# EAGLE design i2c_rs232_interface (EAGLE 7.3.0)
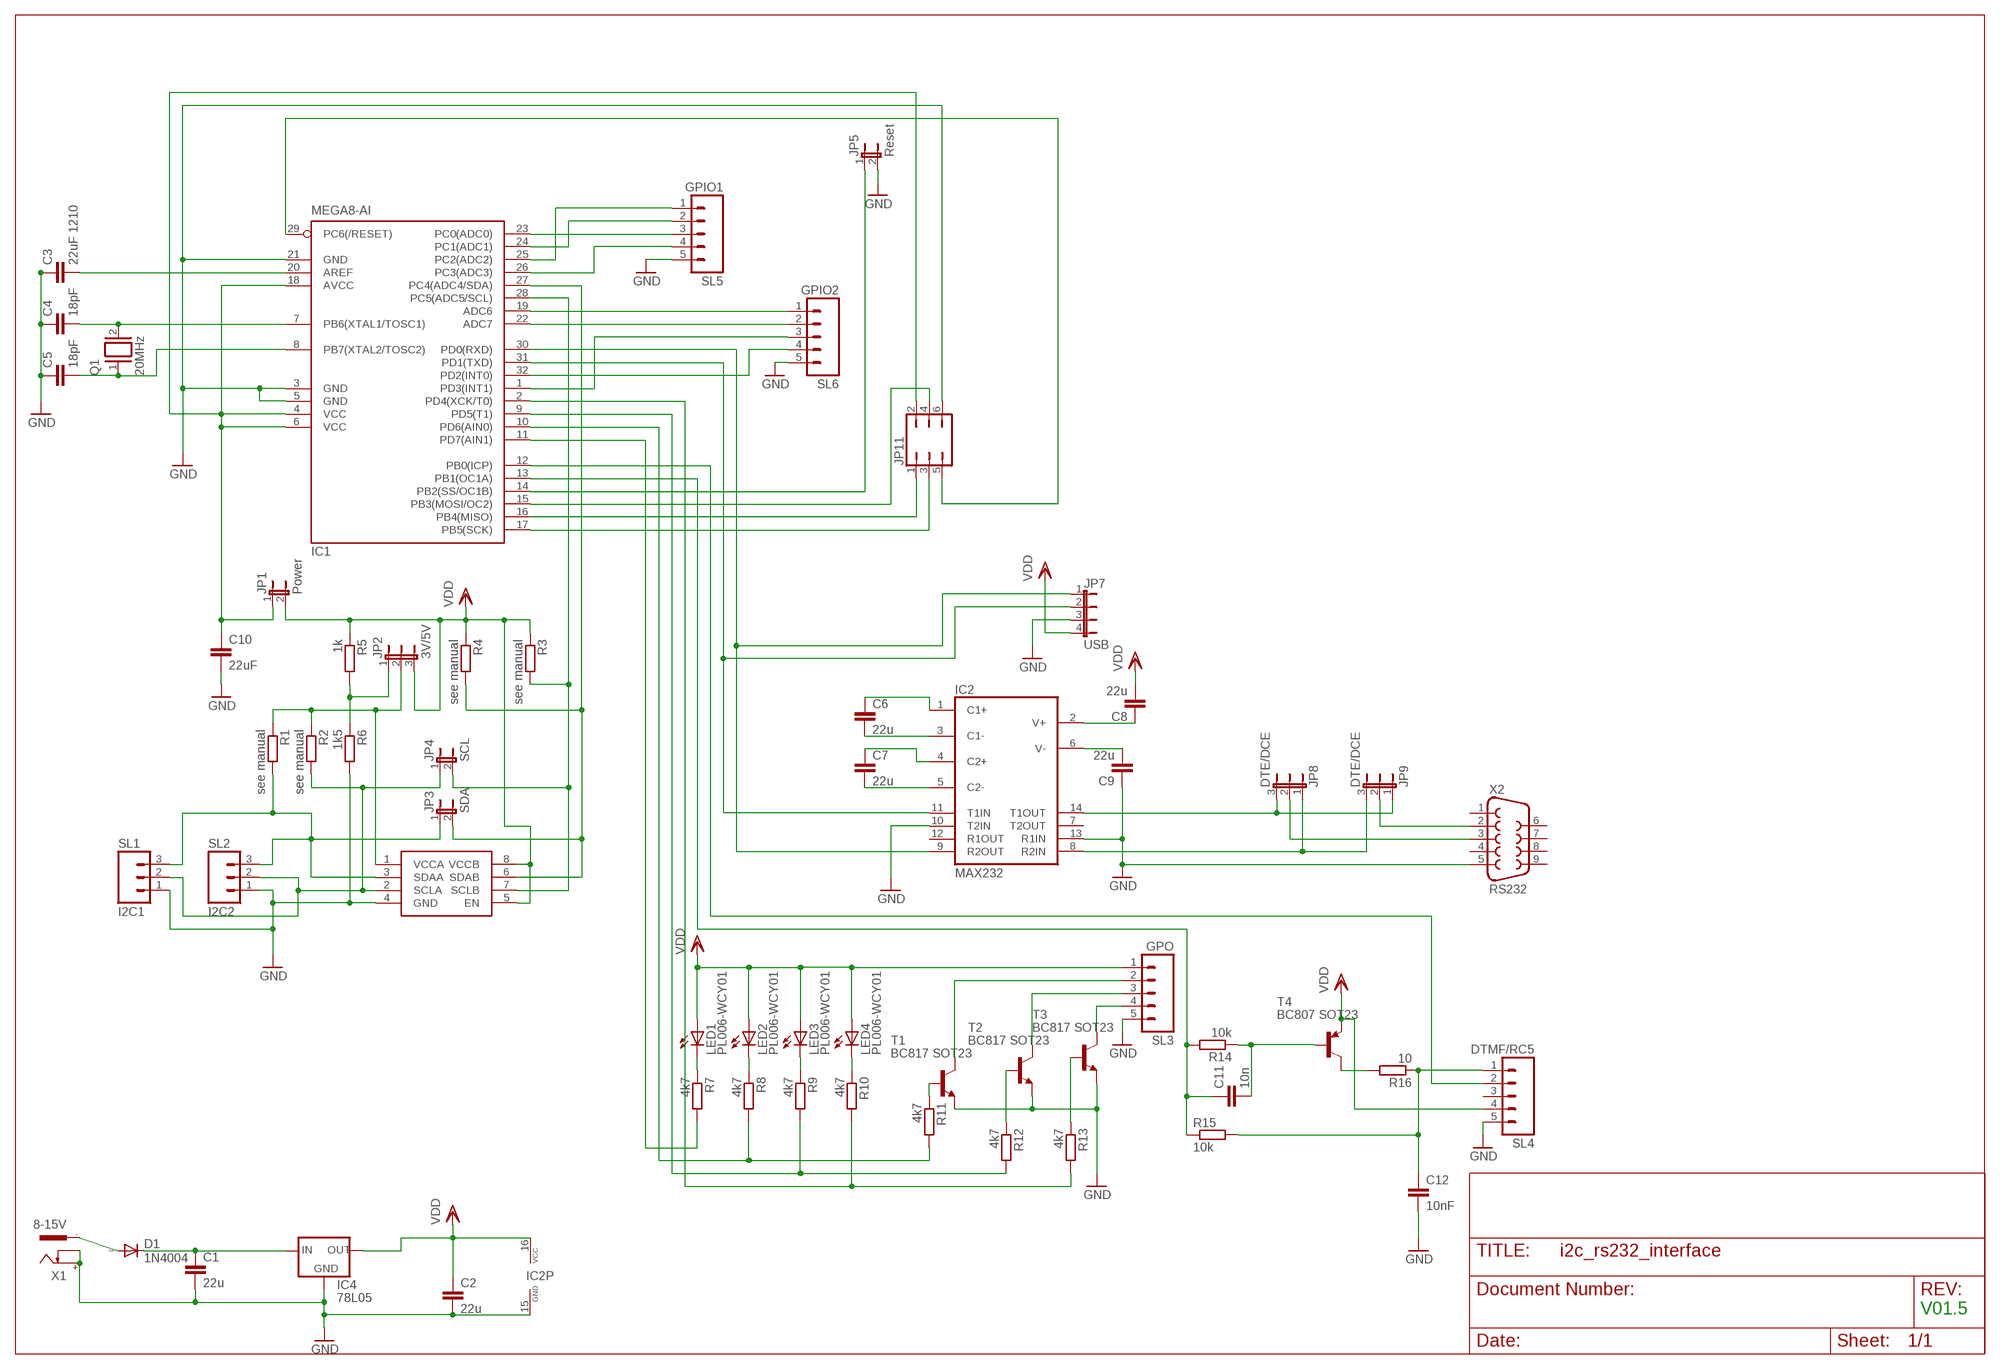
[diagram p0: schematic, sheet 1]

## Parts
C1  22u  C-EUC1206  [C1206]
C2  22u  C-EUC1206  [C1206]
C3  22uF 1210  C-EUC1206  [C1206]
C4  18pF  C-EU025-025X050  [C025-025X050]
C5  18pF  C-EU025-025X050  [C025-025X050]
C6  22u  C-EUC1206  [C1206]
C7  22u  C-EUC1206  [C1206]
C8  22u  C-EUC1206  [C1206]
C9  22u  C-EUC1206  [C1206]
C10  22uF  C-EUC1206  [C1206]
C11  10n  C-EUC1206  [C1206]
C12  10nF  C-EUC1206  [C1206]
D1  1N4004  [DO41-10]
IC1  MEGA8-AI  [TQFP32-08]
IC2  MAX232  [DIL16]
IC3  PCA9517  [SO-08]
IC4  78L05  78LXX  [78LXX]
JP1  Power  JP1E  [JP1]
JP2  3V/5V  JP2E  [JP2]
JP3  SDA  JP1E  [JP1]
JP4  SCL  JP1E  [JP1]
JP5  Reset  JP1E  [JP1]
JP7  USB  JP4E  [JP4]
JP8  DTE/DCE  JP2E  [JP2]
JP9  DTE/DCE  JP2E  [JP2]
JP11  JP3Q  [JP3Q]
LED1  PL006-WCY01  [SOT23]
LED2  PL006-WCY01  [SOT23]
LED3  PL006-WCY01  [SOT23]
LED4  PL006-WCY01  [SOT23]
Q1  20MHz  XTAL/S  [QS]
R1  see manual  R-EU_R1206  [R1206]
R2  see manual  R-EU_R1206  [R1206]
R3  see manual  R-EU_R1206  [R1206]
R4  see manual  R-EU_R1206  [R1206]
R5  1k  R-EU_R1206  [R1206]
R6  1k5  R-EU_R1206  [R1206]
R7  4k7  R-EU_R1206  [R1206]
R8  4k7  R-EU_R1206  [R1206]
R9  4k7  R-EU_R1206  [R1206]
R10  4k7  R-EU_R1206  [R1206]
R11  4k7  R-EU_R1206  [R1206]
R12  4k7  R-EU_R1206  [R1206]
R13  4k7  R-EU_R1206  [R1206]
R14  10k  R-EU_R1206  [R1206]
R15  10k  R-EU_R1206  [R1206]
R16  10  R-EU_R1206  [R1206]
SL1  I2C1  M03  [03P]
SL2  I2C2  M03  [03P]
SL3  GPO  M05  [05P]
SL4  DTMF/RC5  M05  [05P]
SL5  GPIO1  M05  [05P]
SL6  GPIO2  M05  [05P]
T1  BC817 SOT23  BC817-NPN-SOT23-BEC  [SOT23-BEC]
T2  BC817 SOT23  BC817-NPN-SOT23-BEC  [SOT23-BEC]
T3  BC817 SOT23  BC817-NPN-SOT23-BEC  [SOT23-BEC]
T4  BC807 SOT23  BC807-25SMD  [SOT23-BEC]
X1  8-15V  737992-55  [737992-5]
X2  RS232  F09H  [F09H]

## Nets
C13: C6.1 IC2.1(C1+)
GND: C1.2 C2.2 C3.1 C4.1 C5.1 C9.1 C10.2 C12.2 IC1.3(GND) IC1.5(GND) IC1.21(GND) IC2.10(T2IN) IC2.13(R1IN) IC2.15(GND) IC3.4(GND) IC4.GND JP5.2 JP7.3 JP11.6 R6.2 SL1.1 SL2.1 SL3.5 SL4.5 SL5.5 SL6.5 T1.E T2.E T3.E X1.+ X1.K X2.5
N$1: IC1.11(PD7(AIN1)) R7.2
N$2: IC1.30(PD0(RXD)) IC2.9(R2OUT) JP7.1
N$3: C7.2 IC2.5(C2-)
N$4: JP9.2 X2.2
N$5: IC1.27(PC4(ADC4/SDA)) IC3.6(SDAB) JP3.2 R4.2
N$6: IC1.14(PB2(SS/OC1B)) JP5.1
N$7: IC1.25(PC2(ADC2)) SL5.1
N$8: R11.1 T1.B
N$9: JP8.2 X2.3
N$10: IC2.14(T1OUT) JP8.3 JP9.1
N$11: C10.1 IC1.4(VCC) IC1.6(VCC) IC1.18(AVCC) JP1.1 JP11.2
N$12: IC1.31(PD1(TXD)) IC2.11(T1IN) JP7.2
N$13: C7.1 IC2.4(C2+)
N$14: C6.2 IC2.3(C1-)
N$15: IC1.16(PB4(MISO)) JP11.1
N$16: C8.1 IC2.2(V+)
N$17: C9.2 IC2.6(V-)
N$18: IC1.29(PC6(/RESET)) JP11.5
N$19: C4.2 IC1.7(PB6(XTAL1/TOSC1)) Q1.2
N$20: IC1.17(PB5(SCK)) JP11.3
N$21: IC1.19(ADC6) SL6.1
N$22: IC1.28(PC5(ADC5/SCL)) IC3.7(SCLB) JP4.2 R3.2
N$23: IC1.10(PD6(AIN0)) R8.2 R11.2
N$24: R13.1 T3.B
N$25: IC1.9(PD5(T1)) R9.2 R12.2
N$26: IC1.23(PC0(ADC0)) SL5.3
N$27: D1.A X1.-1
N$28: IC1.15(PB3(MOSI/OC2)) JP11.4
N$29: C11.2 R14.1 T4.B
N$30: C11.1 IC1.13(PB1(OC1A)) R14.2 R15.1
N$31: R16.2 T4.C
N$32: C12.1 R15.2 R16.1 SL4.1
N$33: C1.1 D1.C IC4.IN
N$34: R12.1 T2.B
N$35: C3.2 IC1.20(AREF)
N$36: IC1.24(PC1(ADC1)) SL5.2
N$37: C5.2 IC1.8(PB7(XTAL2/TOSC2)) Q1.1
N$38: IC3.2(SCLA) JP4.1 R2.2 SL1.2 SL2.2
N$39: IC1.26(PC3(ADC3)) SL5.4
N$40: IC1.1(PD3(INT1)) SL6.3
N$41: IC2.8(R2IN) JP8.1 JP9.3
N$42: IC1.12(PB0(ICP)) SL4.2
N$43: LED4.3(C) R10.1
N$44: IC3.3(SDAA) JP3.1 R1.2 SL1.3 SL2.3
N$45: SL3.2 T1.C
N$46: SL3.3 T2.C
N$47: SL3.4 T3.C
N$48: LED3.3(C) R9.1
N$49: LED2.3(C) R8.1
N$50: LED1.3(C) R7.1
N$51: IC1.32(PD2(INT0)) SL6.4
N$52: IC1.2(PD4(XCK/T0)) R10.2 R13.2
N$53: JP2.1 R5.2 R6.1
N$54: IC1.22(ADC7) SL6.2
N$56: IC3.1(VCCA) JP2.2 R1.1 R2.1
VDD: C2.1 C8.2 IC2.16(VCC) IC3.5(EN) IC3.8(VCCB) IC4.OUT JP1.2 JP2.3 JP7.4 LED1.1(A) LED2.1(A) LED3.1(A) LED4.1(A) R3.1 R4.1 R5.1 SL3.1 SL4.4 T4.E
Unconnected: IC2.7(T2OUT) IC2.12(R1OUT) SL4.3 X1.-2 X2.1 X2.4 X2.6 X2.7 X2.8 X2.9

## Notes on the sheet
- V01.5

## Library data of the parts
C1-C3 C6-C10 = rcl:C-EU: CAPACITOR, European symbol
C4 C5 C11 C12 = resistor:C-EU: CAPACITOR, European symbol
D1 = diode:1N4004: DIODE general purpose rectifier, 1 A
IC1 = atmel:MEGA8: MICROCONTROLLER 8 Kbytes FLASH, 1 kbytes SRAM, 512 bytes EEPROM, USART, 6-channel 10 bit ADC, 2-channel 8 bit ADC Pin compatible with Atmega48, ATMega88, ATMega168 Source: avr.lbr; MPN: ATMEGA8-16AU; OC_FARNELL: 9171371; OC_NEWARK: 73M8863
IC2 = maxim:MAX232: RS232 TRANSCEIVER; MF: MAXIM; MPN: MAX232ACPE+; OC_FARNELL: 9723773; OC_NEWARK: 68K4544
IC3 = PCA9517:PCA9517: PCA9517
IC4 = v-reg:78LXX: VOLTAGE REGULATOR
JP1 JP3-JP5 = jumper:JP1E: JUMPER
JP2 JP8 JP9 = jumper:JP2E: JUMPER
JP7 = jumper:JP4E: JUMPER
JP11 = jumper:JP3Q: JUMPER
LED1-LED4 = led:PL006*: PLH006 Series SMD LED SOT23 PLH006-WCR21 Super Red PLH006-WCR12 High Eff Red PLH006-WCG13 Green PLH006-WCY01 Yellow www.p-tec.net Source: http://www.wittig-electronic.de/PTEC/PL006Series.pdf
Q1 = special:XTAL/S: CRYSTAL
R1-R16 = resistor:R-EU_: RESISTOR, European symbol
SL1 SL2 = con-amp-quick:M03: AMP QUICK CONNECTOR; OC_FARNELL: unknown; OC_NEWARK: unknown
SL3-SL6 = con-amp-quick:M05: AMP QUICK CONNECTOR; OC_FARNELL: unknown; OC_NEWARK: unknown
T1-T3 = transistor:*-NPN-: NPN Transistror BF959 corrected 2008.03.06
T4 = transistor-pnp:BC807*: PNP Transistror
X1 = con-conrad:737992-55: FEMALE PRINT CONNECTOR DIN 45323 (34V/3A), ROKA, distributor Conrad
X2 = con-subd:F09: SUB-D; OC_FARNELL: unknown; OC_NEWARK: unknown

## Board
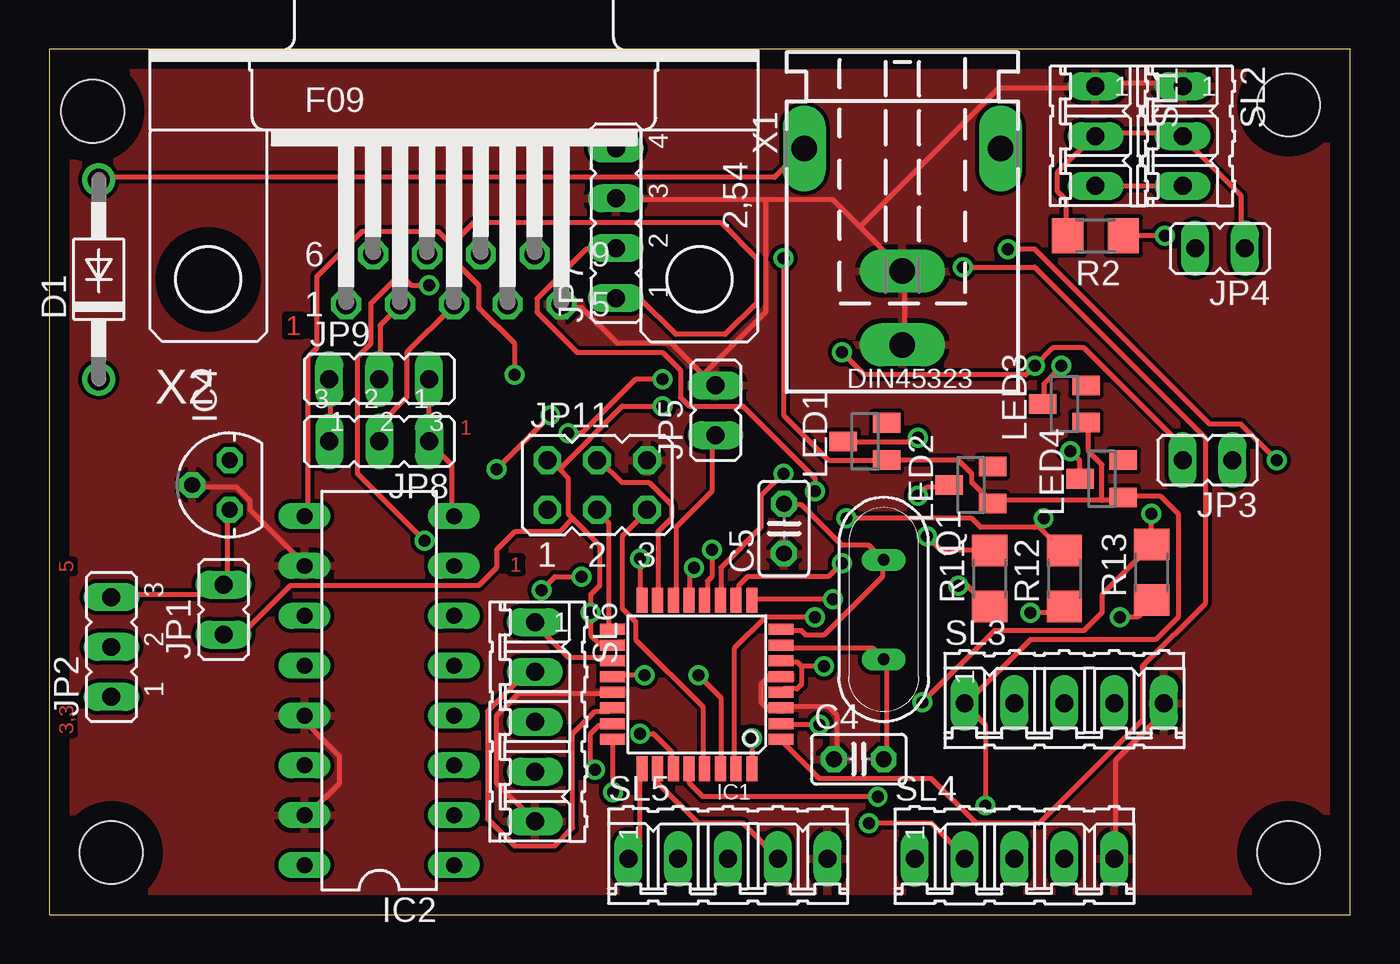
[diagram p1: board, top side]
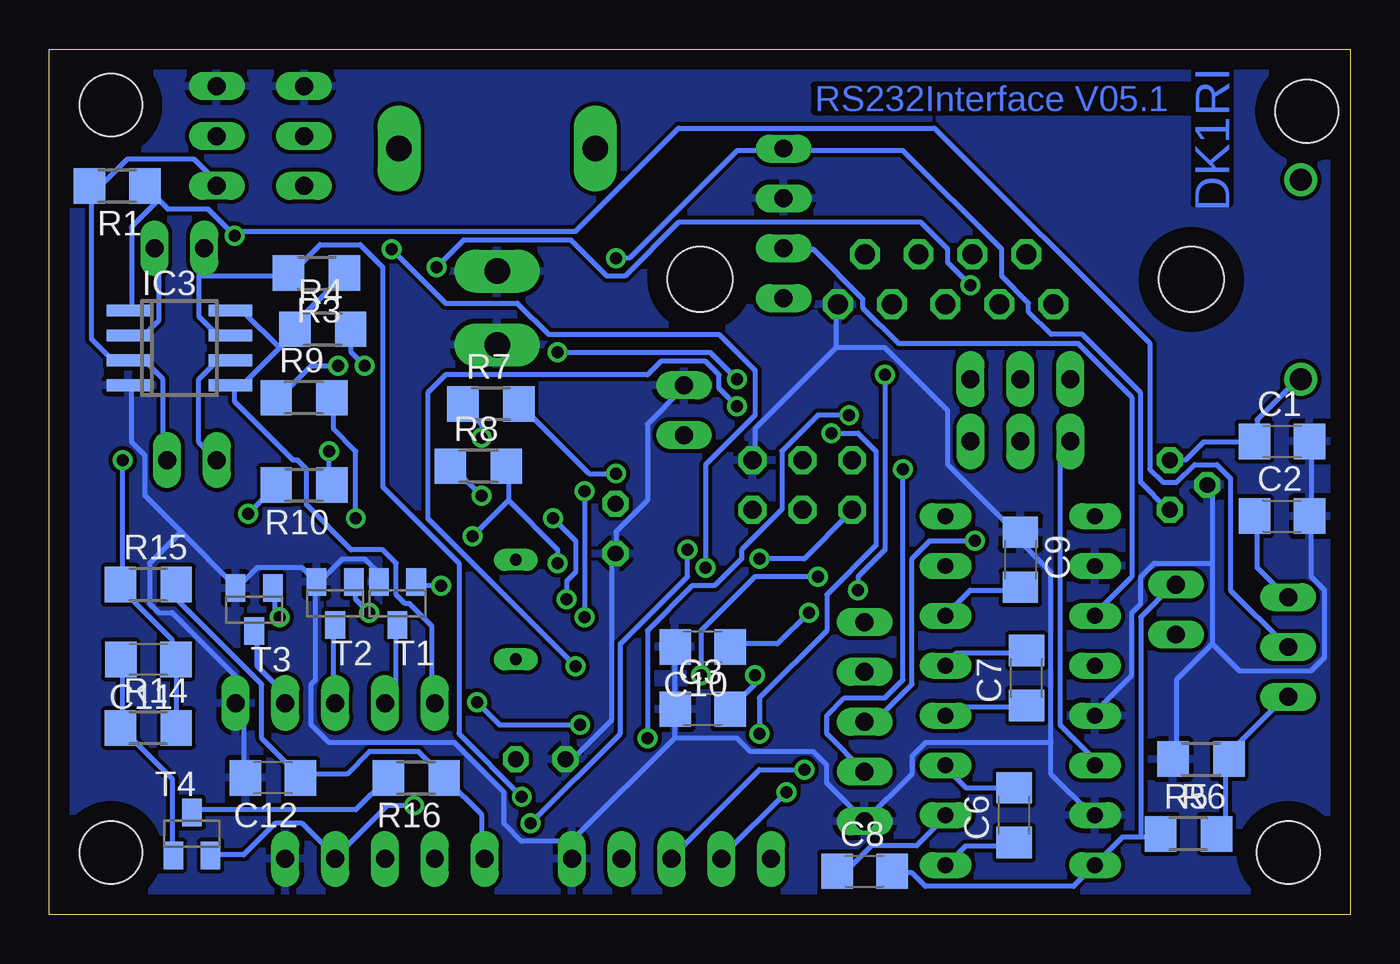
[diagram p2: board, bottom side, seen from below]

Size 66.34 x 44.12 mm. Coordinates in mm from the lower left corner, seen from the top.
Outline: 0,0 66.34,0 66.34,44.12 0,44.12 0,0
Copper layers (1*16): Top 0.035mm / dielectric 1.5mm / Bottom 0.035mm
Design rules "default": minimum track width 10mil, minimum drill 24mil, track to track 8mil, track to pad 8mil, pad to pad 8mil, via to via 8mil, smd to smd 8mil, copper to edge 40mil, drill to drill 8mil, minimum pad ring 10mil, minimum via ring 8mil, stop-mask expansion 4mil, vias tented up to drill 0mil, thermal gap 10mil
Holes 3.2 mm at 2.22,40.96 63.18,41.27 63.18,3.17 3.17,3.17

### Footprints (pad centres in the part's own frame; a part is rotated, then mirrored left to right if it is on the bottom)
C1206 = smd 1.6 x 1.8: 1 -1.4,0; 2 1.4,0
C025-025X050 = drill 0.813 octagon: 1 -1.27,0; 2 1.27,0
DO41-10 = drill 1.118: A 5.08,0; C -5.08,0
TQFP32-08 = smd 1.27 x 0.559: 1 -4.293,2.8; 2 -4.293,2; 3 -4.293,1.2; 4 -4.293,0.4; 5 -4.293,-0.4; 6 -4.293,-1.2; 7 -4.293,-2; 8 -4.293,-2.8; 17 4.293,-2.8; 18 4.293,-2; 19 4.293,-1.2; 20 4.293,-0.4; 21 4.293,0.4; 22 4.293,1.2; 23 4.293,2; 24 4.293,2.8 | smd 0.559 x 1.27: 9 -2.8,-4.293; 10 -2,-4.293; 11 -1.2,-4.293; 12 -0.4,-4.293; 13 0.4,-4.293; 14 1.2,-4.293; 15 2,-4.293; 16 2.8,-4.293; 25 2.8,4.293; 26 2,4.293; 27 1.2,4.293; 28 0.4,4.293; 29 -0.4,4.293; 30 -1.2,4.293; 31 -2,4.293; 32 -2.8,4.293
DIL16 = drill 0.813 long: 1 -8.89,-3.81; 2 -6.35,-3.81; 3 -3.81,-3.81; 4 -1.27,-3.81; 5 1.27,-3.81; 6 3.81,-3.81; 7 6.35,-3.81; 8 8.89,-3.81; 9 8.89,3.81; 10 6.35,3.81; 11 3.81,3.81; 12 1.27,3.81; 13 -1.27,3.81; 14 -3.81,3.81; 15 -6.35,3.81; 16 -8.89,3.81
SO-08 = smd 0.6 x 2.2: 1 -1.905,-2.6; 2 -0.635,-2.6; 3 0.635,-2.6; 4 1.905,-2.6; 5 1.905,2.6; 6 0.635,2.6; 7 -0.635,2.6; 8 -1.905,2.6
78LXX = drill 0.813 octagon: GND 0,1.905; IN 1.27,0; OUT -1.27,0
JP1 = drill 0.914 long: 1 0,-1.27; 2 0,1.27
JP2 = drill 0.914 long: 1 -2.54,0; 2 0,0; 3 2.54,0
JP4 = drill 0.914 long: 1 -3.81,0; 2 -1.27,0; 3 1.27,0; 4 3.81,0
JP3Q = drill 0.914 octagon: 1 -2.54,-1.27; 2 -2.54,1.27; 3 0,-1.27; 4 0,1.27; 5 2.54,-1.27; 6 2.54,1.27
SOT23 = smd 1 x 1.4: 1 -0.95,-1.1; 2 0.95,-1.1; 3 0,1.1
QS = drill 0.61 long: 1 -2.54,0; 2 2.54,0
R1206 = smd 1.6 x 1.803: 1 -1.422,0; 2 1.422,0
03P = drill 0.914 long: 1 -2.54,0; 2 0,0; 3 2.54,0
05P = drill 0.914 long: 1 -5.08,0; 2 -2.54,0; 3 0,0; 4 2.54,0; 5 5.08,0
SOT23-BEC = smd 1 x 1.4: B -0.95,-1.1; C 0,1.1; E 0.95,-1.1
737992-5 = drill 1.3 pad 2.184 long: + 0,10; -1 5,0; -2 -5,0; K 0,6.25
F09H = drill 1.016 octagon: 1 -5.486,-1.27; 2 -2.743,-1.27; 3 0,-1.27; 4 2.743,-1.27; 5 5.486,-1.27; 6 -4.115,1.27; 7 -1.372,1.27; 8 1.372,1.27; 9 4.115,1.27 | hole 3.302: -12.522,0; 12.522,0

### Placement (x,y rotation side)
C1  3.49,24.13 0 bottom
C2  3.49,20.32 0 bottom
C3  33.02,10.48 0 bottom
C4  41.27,7.94 0 top
C5  37.47,19.68 90 top
C6  17.14,5.08 90 bottom
C7  16.51,12.06 90 bottom
C8  24.76,2.22 0 bottom
C9  16.83,18.1 270 bottom
C10  33.02,13.65 180 bottom
C11  61.28,13.02 180 bottom
C12  54.93,6.99 180 bottom
D1  2.54,32.38 90 top
IC1  33.02,11.75 180 top
IC2  16.83,11.43 90 top
IC3  59.69,28.89 270 bottom
IC4  9.21,21.91 90 top
JP1  8.89,15.56 0 top
JP2  3.17,13.65 90 top
JP3  59.05,23.18 90 top
JP4  59.69,33.97 90 top
JP5  33.97,25.72 0 top
JP7  28.89,35.24 90 top
JP8  16.83,24.13 180 top
JP9  16.83,27.3 0 top
JP11  27.94,21.91 0 top
LED1  41.59,24.13 90 top
LED2  46.99,21.91 90 top
LED3  51.75,26.04 90 top
LED4  53.66,22.22 90 top
Q1  42.55,15.56 270 top
R1  62.86,37.15 180 bottom
R2  53.34,34.61 180 top
R3  52.7,32.7 180 bottom
R4  52.39,29.84 0 bottom
R5  8.25,4.13 0 bottom
R6  7.62,7.94 180 bottom
R7  43.81,26.04 0 bottom
R8  44.45,22.86 0 bottom
R9  53.34,26.35 0 bottom
R10  53.34,21.91 180 bottom
R11  47.94,17.14 90 top
R12  51.75,17.14 90 top
R13  56.2,17.46 90 top
R14  61.28,9.52 0 bottom
R15  61.28,16.83 0 bottom
R16  47.62,6.99 180 bottom
SL1  53.34,39.69 270 top
SL2  57.78,39.69 270 top
SL3  51.75,10.79 0 top
SL4  49.21,2.86 0 top
SL5  34.61,2.86 0 top
SL6  24.76,9.84 270 top
T1  48.58,15.88 180 bottom
T2  51.75,15.88 180 bottom
T3  55.88,15.56 180 bottom
T4  59.05,4.13 0 bottom
X1  43.5,39.05 180 top
X2  20.64,32.38 0 top

### Tracks (layer width: path | path; a pad name or v marks a point on that pad's centre or on a via)
C13
  Bottom 0.254: C6.1 17.32,3.52 19.61,3.52 20.52,2.6 IC2.1
GND
  Top 0.254: IC1.5 37.21,11.98 36.52,11.98 36.3,11.75 36.3,10.83 36.52,10.6 37.21,10.6 IC1.3 37.44,10.6 39.73,10.6 40.18,10.15 40.18,8.09 C4.1 | 33.33,27.52 33.78,27.06 JP5.2 33.33,27.52 | 33.33,27.52 31.72,29.12 28.98,29.12 27.15,30.95 26.24,30.95 X2.5 | SL2.1 57.78,42.38 53.44,42.38 SL1.1 53.21,42.15 48.41,42.15 41.33,35.06 | 36.52,36.44 39.95,36.44 41.33,35.06 | 36.52,36.44 28.98,36.44 JP7.3 | 41.33,35.06 43.38,33.01 X1.K 43.61,32.78 43.61,29.12 X1.+ | 33.33,27.52 36.52,30.72 36.52,36.44 | SL4.5 54.36,3.06 54.36,7.86 56.64,10.15 56.64,10.6 SL3.5 | IC2.10 12.98,17.92 10.24,20.66 10.24,21.12 9.55,21.81 7.49,21.81 IC4.GND | SL6.5 22.81,6.72 22.81,10.15 23.95,11.29 28.52,11.29 IC1.21 | IC2.13 13.21,10.15 13.21,9.69 14.81,8.09 14.81,6.72 13.21,5.12 IC2.15
  Bottom 0.254: 26.24,28.89 30.35,24.78 30.35,23.18 JP11.6 | 26.24,28.89 26.24,30.95 X2.5 | JP5.2 34.01,26.84 35.84,25.01 35.84,21.12 37.44,19.52 37.44,18.61 C5.1 37.67,18.38 37.67,9.92 39.5,8.09 39.95,8.09 C4.1 | C12.2 56.41,7.18 56.41,10.38 SL3.5 56.87,10.83 56.87,12.2 60.07,15.41 60.76,15.41 61.21,15.86 61.21,17.92 59.61,19.52 | T1.E 49.55,17.01 49.55,17.46 50.24,18.15 51.38,18.15 52.53,17.01 T2.E | T2.E 52.76,17.01 53.44,17.69 55.73,17.69 56.64,16.78 T3.E 56.87,16.78 59.61,19.52 | 59.61,19.52 61.44,21.35 61.44,23.41 62.13,24.09 62.13,26.84 IC3.4 | C1.2 2.01,24.09 2.01,20.43 C2.2 2.01,20.21 2.01,17.23 1.32,16.55 1.32,13.12 2.01,12.43 5.66,12.43 7.04,13.8 | 7.04,13.8 8.86,11.98 8.86,8.09 R6.2 | 7.04,17.92 7.04,21.58 7.26,21.81 IC4.GND | 7.04,17.92 7.04,13.8 | C10.2 34.47,13.58 34.47,10.6 C3.1 34.47,10.38 34.47,9 | 39.5,3.75 39.5,3.98 34.47,9 | 39.5,3.75 39.5,3.06 SL5.5 39.5,3.75 | 15.26,8.78 15.26,7.18 13.21,5.12 IC2.15 | 15.26,8.78 15.26,17.46 16.64,18.83 16.64,19.29 C9.1 16.87,19.29 20.52,22.95 20.52,25.69 23.72,28.89 26.24,28.89 | 15.26,8.78 21.67,8.78 22.35,8.09 22.35,7.18 SL6.5 24.87,4.89 26.69,6.72 26.69,7.63 27.38,8.32 30.58,8.32 31.27,9 34.47,9 | 7.04,17.92 10.01,17.92 10.69,17.23 10.69,15.86 11.15,15.41 11.15,12.2 12.98,10.38 IC2.13 | 39.5,3.75 42.24,3.75 43.16,4.66 43.16,6.26 45.67,8.78 52.07,8.78 52.98,9.69 52.98,11.75 52.76,11.98 52.76,16.78 T2.E
  pour Top: 0.63,43.5 65.41,43.5 65.41,0.95 0.63,0.95
  pour Bottom: 1.27,43.5 65.41,43.5 65.41,0.95 0.63,0.95 0.63,43.5
N$1  (via drill 0.61)
  Top 0.254: v37.44,22.49 36.3,21.35 36.3,19.75 34.24,17.69 34.24,16.09 IC1.11
  Bottom 0.254: v37.44,22.49 38.81,22.49 42.24,25.92 R7.2
N$2  (via drill 0.61)
  Top 0.254: v33.1,12.2 34.24,11.06 34.24,7.63 IC1.30 | v27.15,17.23 25.78,17.23 v25.09,16.55 | v23.72,27.52 23.72,29.12 21.89,30.95 21.89,32.09 20.52,33.46 20.52,34.15 | 20.52,34.15 19.84,34.84 15.95,34.84 13.66,32.55 13.66,28.89 13.21,28.44 13.21,20.43 IC2.9 | 20.52,34.15 21.67,35.29 34.24,35.29 36.07,33.46 36.07,31.18 34.47,29.58 31.95,29.58 30.12,31.41 28.98,31.41 JP7.1
  Bottom 0.254: v33.1,12.2 33.1,14.49 30.35,17.23 v27.15,17.23 | v25.09,16.55 25.09,17.23 23.72,18.61 v23.72,27.52
N$3
  Bottom 0.254: C7.2 16.64,13.35 20.07,13.35 20.52,12.89 IC2.5
N$4
  Top 0.254: JP9.2 16.87,27.52 16.87,30.04 17.78,30.95 X2.2
N$5  (via drill 0.61)
  Top 0.254: v30.12,9.23 30.81,9.23 31.72,8.32 31.72,7.63 IC1.27 | v26.47,24.55 27.15,24.55 29.9,27.29 v31.27,27.29 | v40.41,28.66 41.55,27.52 49.78,27.52 v50.24,27.98 51.16,28.89 52.76,28.89 57.78,23.86 JP3.2
  Bottom 0.254: v30.12,9.23 30.12,11.06 26.69,14.49 26.69,16.32 24.18,18.83 24.18,23.63 25.09,24.55 v26.47,24.55 | v31.27,27.29 32.64,28.66 v40.41,28.66 | v50.24,27.98 50.93,28.66 50.93,29.81 R4.2 | JP3.2 58.7,24.09 58.7,27.29 57.78,28.21 57.1,28.21 IC3.6
N$6
  Top 0.254: IC1.14 31.95,16.09 31.95,19.75 33.78,21.58 33.78,24.32 JP5.1
N$7
  Top 0.254: IC1.25 30.12,7.4 30.12,3.52 29.67,3.06 SL5.1
N$8  (via drill 0.61)
  Top 0.254: v46.36,16.78 46.81,16.78 47.73,15.86 R11.1
  Bottom 0.254: v46.36,16.78 47.5,16.78 T1.B
N$9
  Top 0.254: JP8.2 16.87,24.32 16.87,25.01 18.24,26.38 18.24,28.66 20.52,30.95 X2.3
N$10
  Top 0.254: JP9.1 14.35,27.29 14.35,24.32 JP8.3
  Bottom 0.254: IC2.14 13.21,7.63 13.21,8.09 14.81,9.69 14.81,23.63 14.35,24.09 JP8.3
N$11  (via drill 0.61)
  Top 0.254: 38.35,12.66 38.35,11.75 38.12,11.52 37.44,11.52 IC1.4 | 38.35,12.66 38.12,12.89 37.44,12.89 IC1.6 | 26.69,20.21 26.47,20.43 26.47,22.26 26.01,22.72 | 26.69,20.21 28.07,18.83 28.07,16.78 27.61,16.32 v27.61,15.41 27.61,14.26 28.07,13.8 28.52,13.8 IC1.18 | 26.01,22.72 25.55,23.18 JP11.2 | v39.5,12.66 38.35,12.66 | v31.27,25.92 29.21,25.92 26.01,22.72 | 26.69,20.21 26.01,19.52 23.72,19.52 22.81,18.61 22.81,17.69 21.89,16.78 12.29,16.78 10.01,14.49 9.09,14.49 JP1.1
  Bottom 0.254: v27.61,15.41 29.21,13.8 31.5,13.8 C10.1 | v39.5,12.66 47.04,20.21 47.04,26.61 46.13,27.52 35.84,27.52 35.15,28.21 32.87,28.21 32.18,27.52 32.18,26.84 v31.27,25.92
N$12  (via drill 0.61)
  Top 0.254: v39.04,15.18 36.52,15.18 34.92,13.58 34.92,7.63 IC1.31 | v39.04,21.58 39.04,22.26 35.38,25.92 32.64,25.92 32.18,26.38 32.18,27.75 31.27,28.66 26.92,28.66 24.87,30.72 24.87,31.41 27.38,33.92 28.75,33.92 JP7.2
  Bottom 0.254: v39.04,21.58 v39.04,15.18 | IC2.11 12.98,15.41 11.15,17.23 11.15,26.38 13.89,29.12 23.04,29.12 24.87,30.95 24.87,31.41 27.38,33.92 28.75,33.92 JP7.2
N$13
  Bottom 0.254: C7.1 16.64,10.6 20.29,10.6 20.52,10.38 IC2.4
N$14
  Bottom 0.254: C6.2 17.32,6.49 19.61,6.49 20.52,7.4 IC2.3
N$15  (via drill 0.61)
  Top 0.254: v30.12,18.15 30.12,16.09 IC1.16
  Bottom 0.254: v30.12,18.15 27.84,18.15 25.55,20.43 JP11.1
N$16
  Bottom 0.254: C8.1 26.01,2.37 25.55,2.37 24.41,3.52 22.12,3.52 20.75,4.89 IC2.2
N$17
  Bottom 0.254: C9.2 16.87,16.55 19.38,16.55 20.52,15.41 IC2.6
N$18
  Top 0.254: IC1.29 33.33,7.63 33.33,10.6 29.9,14.03 29.9,14.95 29.21,15.63 29.21,19.29 30.35,20.43 JP11.5
N$19
  Top 0.254: IC1.7 37.44,13.58 42.01,13.58 42.47,13.12 Q1.2 42.7,12.89 42.7,8.09 C4.2
N$20
  Top 0.254: IC1.17 28.52,14.72 28.52,19.98 28.07,20.43 JP11.3
N$21
  Top 0.254: IC1.19 28.52,13.12 26.47,13.12 24.87,14.72 SL6.1
N$22  (via drill 0.61)
  Top 0.254: v42.24,6.03 33.33,6.03 32.64,6.72 32.64,7.4 IC1.28
  Bottom 0.254: 58.7,32.55 58.7,33.69 JP4.2 | 58.7,32.55 58.7,30.49 57.78,29.58 57.1,29.58 IC3.7 | v42.24,6.03 45.44,9.23 45.44,17.92 49.33,21.81 49.33,33.01 50.47,34.15 52.53,34.15 53.9,32.78 R3.2 54.13,32.55 58.7,32.55
N$23  (via drill 0.61)
  Top 0.254: v40.41,17.92 39.73,17.23 35.61,17.23 35.15,16.78 35.15,16.09 IC1.10 | v44.75,19.29 45.44,18.61 47.73,18.61 R11.2
  Bottom 0.254: v40.41,17.92 40.41,18.61 42.93,21.12 | 42.93,21.12 42.93,22.72 R8.2 | 42.93,21.12 v44.75,19.29
N$24  (via drill 0.61)
  Top 0.254: v54.58,15.18 55.5,15.18 56.18,15.86 R13.1
  Bottom 0.254: v54.58,15.18 54.81,15.41 54.81,16.55 T3.B
N$25  (via drill 0.61)
  Top 0.254: v39.95,16.09 35.84,16.09 IC1.9 | v40.64,20.21 47.04,20.21 47.5,19.75 50.24,19.75 | 50.24,19.75 50.47,19.75 51.61,18.61 R12.2 | 50.24,19.75 v50.7,20.21
  Bottom 0.254: v39.95,16.09 39.95,17.01 39.5,17.46 39.5,19.06 v40.64,20.21 | v50.7,20.21 50.7,23.63 51.84,24.78 51.84,26.15 R9.2
N$26  (via drill 0.61)
  Top 0.254: v27.84,7.4 27.61,7.63 27.61,9.23 28.07,9.69 28.52,9.69 IC1.23
  Bottom 0.254: v27.84,7.4 30.12,7.4 34.47,3.06 SL5.3
N$27
  Top 0.254: D1.A 2.69,37.58 36.98,37.58 38.35,38.95 X1.-1
N$28
  Top 0.254: IC1.15 31.04,16.09 31.04,19.52 31.72,20.21 31.72,20.89 30.58,22.03 29.21,22.03 28.07,23.18 JP11.4
N$29
  Bottom 0.254: T4.B 60.07,3.06 60.07,6.95 62.59,9.46 R14.1 62.59,9.69 62.59,12.89 C11.2
N$30  (via drill 0.61)
  Top 0.254: v32.87,17.69 32.64,17.46 32.64,16.09 IC1.13 | v48.87,33.92 50.24,33.92 59.16,25.01 60.76,25.01 v62.59,23.18
  Bottom 0.254: R14.2 59.84,9.69 59.84,12.89 C11.1 60.07,13.12 60.07,14.03 62.81,16.78 R15.1 62.59,17.01 v62.59,23.18 | v32.87,17.69 32.87,22.95 30.35,25.46 30.35,27.75 32.18,29.58 40.87,29.58 42.47,31.18 46.13,31.18 v48.87,33.92
N$31
  Bottom 0.254: T4.C 58.93,5.35 50.7,5.35 49.1,6.95 R16.2
N$32
  Bottom 0.254: R15.2 59.84,16.78 59.84,16.09 55.5,11.75 55.5,9 53.67,7.18 C12.1 53.44,7.18 51.16,7.18 50.01,8.32 47.5,8.32 46.36,7.18 R16.1 46.13,6.95 44.3,5.12 44.3,3.06 SL4.1
N$33
  Bottom 0.254: D1.C 2.69,27.29 4.75,25.23 4.75,24.32 C1.1 4.98,24.09 7.49,24.09 8.41,23.18 IC4.IN
N$34  (via drill 0.61)
  Top 0.254: v50.01,15.41 51.38,15.41 51.61,15.63 R12.1
  Bottom 0.254: v50.01,15.41 50.7,16.09 50.7,16.78 T2.B
N$35  (via drill 0.61)
  Top 0.254: v30.35,12.2 28.75,12.2 IC1.20
  Bottom 0.254: v30.35,12.2 30.35,11.75 31.5,10.6 C3.2
N$36  (via drill 0.61)
  Top 0.254: v28.75,6.26 28.75,8.78 IC1.24
  Bottom 0.254: v28.75,6.26 31.95,3.06 SL5.2
N$37
  Top 0.254: IC1.8 37.44,14.49 38.35,14.49 38.58,14.26 39.5,14.26 42.47,17.23 42.47,17.92 Q1.1 42.47,18.15 41.78,18.83 40.41,18.83 38.35,20.89 37.67,20.89 C5.2
N$38
  Top 0.254: R2.2 51.84,34.61 51.84,36.44 51.38,36.89 51.38,37.81 53.21,39.64 SL1.2 53.44,39.87 57.78,39.87 SL2.2 57.78,39.64 60.76,36.66 60.76,34.15 JP4.1
  Bottom 0.254: IC3.2 62.13,29.58 61.44,29.58 60.76,30.26 60.76,33.92 JP4.1
N$39
  Top 0.254: IC1.26 31.04,7.4 31.04,6.72 33.1,4.66 35.38,4.66 36.98,3.06 SL5.4
N$40  (via drill 0.61)
  Top 0.254: v46.58,33.01 50.24,33.01 58.93,24.32 58.93,15.86 55.73,12.66 55.73,9.92 50.47,4.66 47.27,4.66 44.98,6.95 39.27,6.95 37.44,8.78 IC1.1 | v19.38,32.09 18.47,32.09 18.24,32.32 17.55,32.32 16.41,31.18 16.41,29.12 15.72,28.44 15.72,22.49 v19.15,19.06
  Bottom 0.254: v46.58,33.01 45.21,34.38 39.73,34.38 37.9,32.55 36.98,32.55 34.24,35.29 21.89,35.29 20.52,33.92 20.52,33.24 v19.38,32.09 | v19.15,19.06 21.44,19.06 22.35,18.15 22.35,11.75 24.18,9.92 24.64,9.92 SL6.3
N$41
  Top 0.254: IC2.8 20.52,20.43 20.52,22.95 19.38,24.09 JP8.1 19.38,24.32 JP9.3
N$42  (via drill 0.61)
  Top 0.254: v33.78,18.61 33.78,17.23 33.55,17.01 33.55,16.09 IC1.12 | v41.78,4.66 44.98,4.66 46.58,3.06 SL4.2
  Bottom 0.254: v33.78,18.61 33.78,17.23 37.21,13.8 37.21,9.23 v41.78,4.66
N$43  (via drill 0.61)
  Top 0.254: v52.07,23.63 52.53,23.18 52.53,22.26 LED4.3
  Bottom 0.254: v52.07,23.63 52.07,22.03 R10.1
N$44
  Top 0.254: SL1.3 53.44,37.12 57.78,37.12 SL2.3
  Bottom 0.254: JP3.1 60.53,23.18 60.53,27.29 61.44,28.21 62.13,28.21 IC3.3 62.36,28.44 63.27,28.44 64.19,29.35 64.19,37.12 R1.2 64.19,37.35 63.5,37.35 62.36,38.49 58.93,38.49 57.78,37.35 SL2.3
N$45
  Bottom 0.254: T1.C 48.64,14.72 48.64,11.29 49.1,10.83 SL3.2
N$46
  Bottom 0.254: T2.C 51.84,14.72 51.84,10.83 SL3.3
N$47
  Bottom 0.254: T3.C 55.73,14.26 55.73,12.66 54.36,11.29 54.36,10.83 SL3.4
N$48  (via drill 0.61)
  Top 0.254: v51.61,27.98 50.7,27.06 50.7,26.15 LED3.3
  Bottom 0.254: v51.61,27.98 52.98,27.98 54.58,26.38 R9.1
N$49  (via drill 0.61)
  Top 0.254: v44.3,21.35 44.75,21.81 45.67,21.81 LED2.3
  Bottom 0.254: v44.3,21.35 45.67,22.72 R8.1
N$50  (via drill 0.61)
  Top 0.254: v44.3,24.32 44.07,24.09 40.64,24.09 LED1.3
  Bottom 0.254: v44.3,24.32 44.3,25.01 45.21,25.92 R7.1
N$51  (via drill 0.61)
  Top 0.254: v35.84,9 35.84,7.63 IC1.32 | v22.81,22.72 v25.55,25.46
  Bottom 0.254: v35.84,9 35.84,14.49 33.55,16.78 32.41,16.78 31.04,18.15 31.04,18.61 28.98,20.66 28.98,23.63 27.15,25.46 v25.55,25.46 | v22.81,22.72 22.81,11.98 23.72,11.06 25.78,11.06 26.69,10.15 26.69,9.23 SL6.4
N$52  (via drill 0.61)
  Top 0.254: v39.27,9.69 37.44,9.69 IC1.2 | v44.53,10.83 48.18,14.49 52.76,14.49 53.67,15.41 53.67,16.32 56.18,18.83 R13.2 56.18,19.06 v56.18,20.43
  Bottom 0.254: v39.27,9.69 43.38,9.69 v44.53,10.83 | v56.18,20.43 54.81,21.81 R10.2
N$53
  Bottom 0.254: R5.2 6.81,4.2 6.35,4.66 6.35,7.86 R6.1 6.35,8.09 3.38,11.06 JP2.1
N$54
  Top 0.254: IC1.22 28.52,10.38 27.84,10.38 26.69,9.23 26.69,4.43 25.78,3.52 23.72,3.52 22.35,4.89 22.35,10.38 24.18,12.2 24.64,12.2 SL6.2
N$56  (via drill 0.61)
  Top 0.254: v56.87,34.61 R2.1
  Bottom 0.254: 57.1,34.84 58.24,35.98 60.3,35.98 60.76,36.44 | 60.76,36.44 61.44,37.12 R1.1 60.76,36.44 | 60.76,36.44 62.13,35.06 62.13,30.95 IC3.1 | 57.1,34.84 39.5,34.84 34.24,40.09 21.21,40.09 10.24,29.12 10.24,22.72 9.55,22.03 8.86,22.03 7.95,22.95 6.81,22.95 6.12,22.26 6.12,16.55 3.38,13.8 JP2.2 | 57.1,34.84 v56.87,34.61
VDD  (via drill 0.61)
  Top 0.254: 53.67,21.12 54.58,21.12 LED4.1 54.81,21.35 56.64,21.35 57.56,20.43 57.56,15.18 56.41,14.03 50.01,14.03 46.81,10.83 SL3.1 46.81,10.6 47.73,9.69 v47.73,5.58 | 53.67,21.12 48.18,21.12 LED2.1 47.95,21.12 47.04,22.03 47.04,22.49 46.36,23.18 LED1.1 42.47,23.18 39.73,23.18 37.44,25.46 v37.44,33.46 | 53.67,21.12 53.67,22.95 52.98,23.63 52.98,25.01 LED3.1 | IC4.OUT 9.09,20.43 9.09,17.01 JP1.2 8.86,16.78 8.41,16.32 3.38,16.32 JP2.3
  Bottom 0.254: R3.1 51.38,32.55 53.9,30.04 R4.1 53.67,29.81 54.58,28.89 | 54.58,28.89 56.41,27.06 56.87,27.06 IC3.5 56.87,26.84 56.87,26.15 53.9,23.18 53.67,23.18 53.21,22.72 53.21,20.89 50.93,18.61 49.33,18.61 48.64,17.92 48.64,16.32 48.18,15.86 47.95,15.86 46.81,14.72 46.81,10.83 SL3.1 | 54.58,28.89 56.41,30.72 56.87,30.72 IC3.8 | T4.E 58.01,3.06 56.41,3.06 54.81,4.66 53.44,4.66 51.84,3.06 SL4.4 51.61,3.06 49.1,5.58 v47.73,5.58 | C8.2 23.27,2.15 22.35,2.15 21.67,1.46 14.12,1.46 13.21,2.37 IC2.16 12.98,2.6 11.61,3.98 10.69,3.98 | 10.69,3.98 9.78,3.98 R5.1 | C2.1 4.75,20.21 4.75,17.69 3.38,16.32 JP2.3 | IC4.OUT 9.32,20.66 10.69,22.03 10.69,26.61 13.66,29.58 15.26,29.58 16.41,30.72 16.41,31.18 17.78,32.55 17.78,33.92 22.81,38.95 28.75,38.95 JP7.4 28.98,38.95 31.27,38.95 36.75,33.46 v37.44,33.46 | 10.69,3.98 10.69,15.18 9.09,16.78 JP1.2

### Text on the board
Top: 1 | 1 | 5 | 1 | 3,3
Bottom: DK1RI | RS232Interface V05.1